# EAGLE design bareduinonano (EAGLE 6.2)
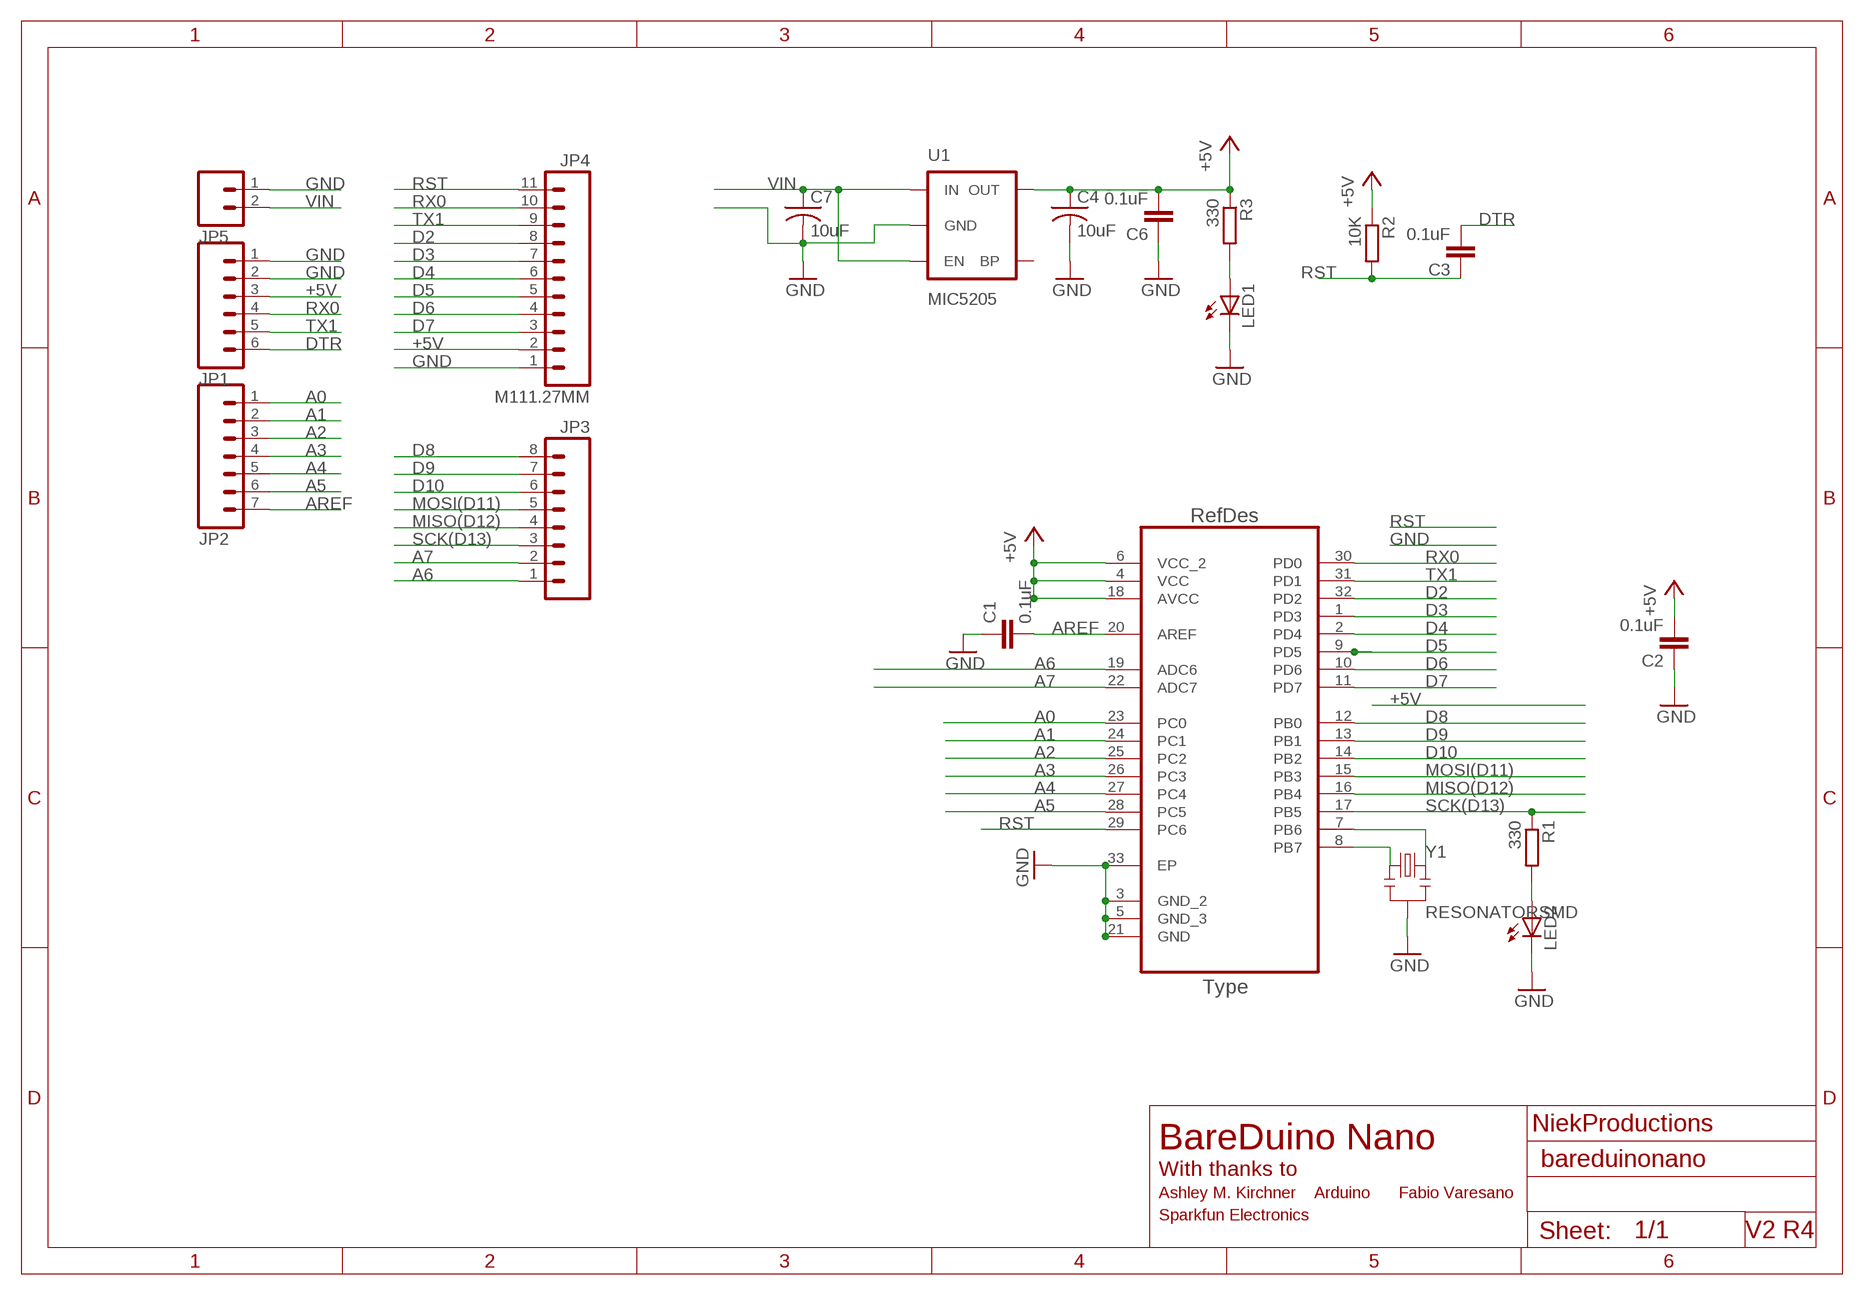
[diagram p0: schematic, sheet 1]

## Parts
C1  0.1uF  C-EUC0402K  [C0402K]
C2  0.1uF  C-EUC0402K  [C0402K]
C3  0.1uF  C-EUC0402K  [C0402K]
C4  10uF  C-USC0603K  [C0603K]
C6  0.1uF  C-EUC0402K  [C0402K]
C7  10uF  C-USC0603K  [C0603K]
JP1  M061.27MM  [1X06-1.27MM]
JP2  M071.27MM  [1X07-1.27MM]
JP3  M081.27MM  [1X08-1.27MM]
JP4  M111.27MM  [1X11-1.27MM]
JP5  M021.27MM  [1X02-1.27MM]
LED1  LED0603  [LED-0603]
LED2  LED0603  [LED-0603]
R1  330  R-EU_R0402  [R0402]
R2  10K  R-EU_R0402  [R0402]
R3  330  R-EU_R0402  [R0402]
U1  MIC5205  V_REG_LDOSMD  [SOT23-5]
UC1  ATMEGA328P-MU  [QFN50P500X500X100-33N]
Y1  RESONATORSMD  [RESONATOR-SMD]

## Nets
+5V: C2.2 C4.1 C6.2 JP1.3 JP4.2 R2.1 R3.1 U1.5(OUT) UC1.4(VCC) UC1.6(VCC_2) UC1.18(AVCC)
A0: JP2.1 UC1.23(PC0)
A1: JP2.2 UC1.24(PC1)
A2: JP2.3 UC1.25(PC2)
A3: JP2.4 UC1.26(PC3)
A4: JP2.5 UC1.27(PC4)
A5: JP2.6 UC1.28(PC5)
A6: JP3.1 UC1.19(ADC6)
A7: JP3.2 UC1.22(ADC7)
AREF: C1.2 JP2.7 UC1.20(AREF)
D2: JP4.8 UC1.32(PD2)
D3: JP4.7 UC1.1(PD3)
D4: JP4.6 UC1.2(PD4)
D5: JP4.5 UC1.9(PD5)
D6: JP4.4 UC1.10(PD6)
D7: JP4.3 UC1.11(PD7)
D8: JP3.8 UC1.12(PB0)
D9: JP3.7 UC1.13(PB1)
D10: JP3.6 UC1.14(PB2)
DTR: C3.2 JP1.6
GND: C1.1 C2.1 C4.2 C6.1 C7.2 JP1.1 JP1.2 JP4.1 JP5.1 LED1.C LED2.C U1.2(GND) UC1.3(GND_2) UC1.5(GND_3) UC1.21(GND) UC1.33(EP) Y1.2
MISO(D12): JP3.4 UC1.16(PB4)
MOSI(D11): JP3.5 UC1.15(PB3)
N$1: UC1.8(PB7) Y1.1
N$2: LED2.A R1.2
N$3: UC1.7(PB6) Y1.3
N$9: LED1.A R3.2
RST: C3.1 JP4.11 R2.2 UC1.29(PC6)
RX0: JP1.4 JP4.10 UC1.30(PD0)
SCK(D13): JP3.3 R1.1 UC1.17(PB5)
TX1: JP1.5 JP4.9 UC1.31(PD1)
VIN: C7.1 JP5.2 U1.1(IN) U1.3(EN)
Unconnected: U1.4(BP)

## Notes on the sheet
- NiekProductions
- BareDuino Nano
- With thanks to
- Ashley M. Kirchner | Arduino | Fabio Varesano
- Sparkfun Electronics
- V2 R4

## Library data of the parts
C1-C3 C6 = resistor:C-EU: CAPACITOR, European symbol
C4 C7 = adafruit:C-US: CAPACITOR, American symbol
JP1 = amk:M06: Header 6 Standard 6-pin 0.1" header. Use with straight break away headers (SKU : PRT-00116), right angle break away headers (PRT-00553), swiss pins (PRT-00743), machine pins (PRT-00117), and female headers (PRT-00115). Molex polarized connector foot print use with SKU : PRT-08094 with associated crimp pins and housings. NOTES ON THE VARIANTS LOCK and LOCK_LONGPADS... This footprint was designed to help hold the alignment of a through-hole component (i.e. 6-pin header) while soldering it into place. You may notice that each hole has been shifted either up or down by 0.005 of an inch from it's more standard position (which is a perfectly straight line). This slight alteration caused the pins (the squares in the middle) to touch the edges of the holes. Because they are alternating, it causes a "brace" to hold the component in place. 0.005 has proven to be the perfect amount of "off-center" position when using our standard breakaway headers. Although looks a little odd when you look at the bare footprint, once you have a header in there, the alteration is very hard to notice. Also, if you push a header all the way into place, it is covered up entirely on the bottom side. This idea of altering the position of holes to aid alignment will be further integrated into the Sparkfun Library for other footprints. It can help hold any component with 3 or more connection pins.
JP2 = amk:M07: Header 7 Standard 7-pin 0.1" header.
JP3 = amk:M08: Header 8 Standard 8-pin 0.1" header. Use with straight break away headers (SKU : PRT-00116), right angle break away headers (PRT-00553), swiss pins (PRT-00743), machine pins (PRT-00117), and female headers (PRT-00115).
JP4 = amk:M11: Header 11 Standard 11-pin 0.1" header. Use with straight break away headers (SKU : PRT-00116), right angle break away headers (PRT-00553), swiss pins (PRT-00743), machine pins (PRT-00117), and female headers (PRT-00115).
JP5 = amk:M02: Header 2 Standard 2-pin 0.1" header. Use with straight break away headers (SKU : PRT-00116), right angle break away headers (PRT-00553), swiss pins (PRT-00743), machine pins (PRT-00117), and female headers (PRT-00115). Molex polarized connector foot print use with SKU : PRT-08233 with associated crimp pins and housings.
LED1 LED2 = SparkFun:LED: LEDs Standard schematic elements and footprints for 5mm, 3mm, 1206, and 0603 sized LEDs. 5mm - Spark Fun Electronics SKU : COM-00529 (and others)
R1-R3 = resistor:R-EU_: RESISTOR, European symbol
U1 = SparkFun:V_REG_LDO: Voltage Regulator LDO Standard 150mA LDO voltage regulator in SOT-23 layout. Micrel part MIC5205. BP (by-pass) pin is used to lower output noise with 470pF cap.
UC1 = Niek:ATMEGA328P-MU; DESCRIPTION: Programmable Flash; MPN: ATMEGA328P-MU; OC_FARNELL: 1748522; OC_NEWARK: 26R2526; PACKAGE: QFN-32; SUPPLIER: Atmel
Y1 = SparkFun:RESONATOR: Resonator Small SMD resonator. This is the itty bitty 10/20MHz resonators with built in caps. CSTCE10M0G55 and CSTCE20M0V53. Footprint has been reviewed closely but hasn't been tested yet.

## Board
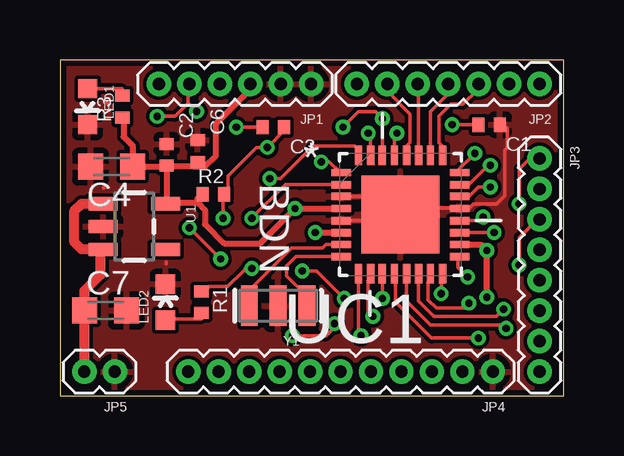
[diagram p1: board, top side]
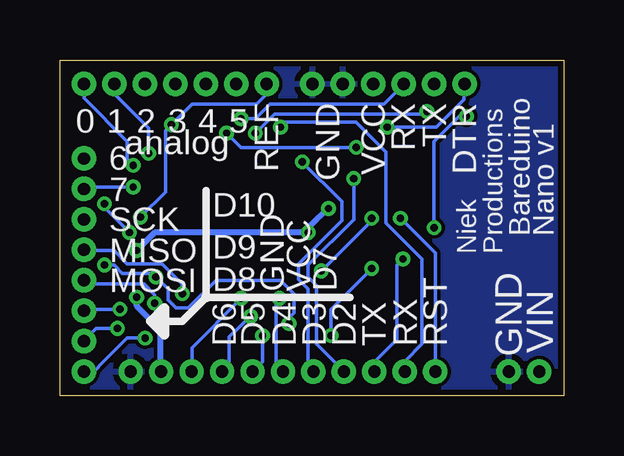
[diagram p2: board, bottom side, seen from below]

Size 21 x 14 mm. Coordinates in mm from the lower left corner, seen from the top.
Outline: 0,0 21,0 21,14 0,14 0,0
Copper layers (1*16): Top 0.035mm / dielectric 1.5mm / Bottom 0.035mm
Design rules: minimum track width 6mil, minimum drill 12mil, track to track 6mil, track to pad 6mil, pad to pad 6mil, via to via 6mil, smd to smd 0mil, copper to edge 10mil, drill to drill 10mil, minimum pad ring 10mil, minimum via ring 6mil, stop-mask expansion 2mil, vias tented up to drill 100mil, thermal gap 10mil

### Footprints (pad centres in the part's own frame; a part is rotated, then mirrored left to right if it is on the bottom)
C0402K = smd 0.5 x 0.6: 1 -0.45,0; 2 0.45,0
C0603K = smd 1.05 x 1.08: 1 -0.875,0; 2 0.875,0
1X06-1.27MM = drill 0.508 pad 1: 1 -3.175,0; 2 -1.905,0; 3 -0.635,0; 4 0.635,0; 5 1.905,0; 6 3.175,0
1X07-1.27MM = drill 0.508 pad 1: 1 -3.81,0; 2 -2.54,0; 3 -1.27,0; 4 0,0; 5 1.27,0; 6 2.54,0; 7 3.81,0
1X08-1.27MM = drill 0.508 pad 1: 1 -4.445,0; 2 -3.175,0; 3 -1.905,0; 4 -0.635,0; 5 0.635,0; 6 1.905,0; 7 3.175,0; 8 4.445,0
1X11-1.27MM = drill 0.508 pad 1: 1 -6.35,0; 2 -5.08,0; 3 -3.81,0; 4 -2.54,0; 5 -1.27,0; 6 0,0; 7 1.27,0; 8 2.54,0; 9 3.81,0; 10 5.08,0; 11 6.35,0
1X02-1.27MM = drill 0.508 pad 1: 1 -0.635,0; 2 0.635,0
LED-0603 = smd 0.8 x 0.8: A 0,-0.75; C 0,0.75
R0402 = smd 0.5 x 0.6: 1 -0.45,0; 2 0.45,0
SOT23-5 = smd 0.55 x 1.2: 1 -0.95,-1.3; 2 0,-1.3; 3 0.95,-1.3; 4 0.95,1.3; 5 -0.95,1.3
QFN50P500X500X100-33N = smd 0.813 x 0.305: 1 -2.464,1.753; 2 -2.464,1.245; 3 -2.464,0.762; 4 -2.464,0.254; 5 -2.464,-0.254; 6 -2.464,-0.762; 7 -2.464,-1.245; 8 -2.464,-1.753; 17 2.464,-1.753; 18 2.464,-1.245; 19 2.464,-0.762; 20 2.464,-0.254; 21 2.464,0.254; 22 2.464,0.762; 23 2.464,1.245; 24 2.464,1.753 | smd 0.305 x 0.813: 9 -1.753,-2.464; 10 -1.245,-2.464; 11 -0.762,-2.464; 12 -0.254,-2.464; 13 0.254,-2.464; 14 0.762,-2.464; 15 1.245,-2.464; 16 1.753,-2.464; 25 1.753,2.464; 26 1.245,2.464; 27 0.762,2.464; 28 0.254,2.464; 29 -0.254,2.464; 30 -0.762,2.464; 31 -1.245,2.464; 32 -1.753,2.464 | smd 3.251 x 3.251: 33 0,0
RESONATOR-SMD = smd 0.7 x 1.7: 1 -1.2,0; 2 0,0; 3 1.2,0

### Placement (x,y rotation side)
C1  17.9,11.3 180 top
C2  4.45,10.05 270 top
C3  8.9,11.2 180 top
C4  2.15,9.55 180 top
C6  5.75,10.2 270 top
C7  1.9,3.55 0 top
JP1  7.3,13 180 top
JP2  16.19,13 180 top
JP3  20,5.45 270 top
JP4  11.7,1 180 top
JP5  1.65,1 180 top
LED1  1.15,12.05 180 top
LED2  4.4,3.9 0 top
R1  5.9,3.9 270 top
R2  6.4,8.4 0 top
R3  2.6,12.05 90 top
U1  3.1,7.05 270 top
UC1  14.2,7.55 0 top
Y1  9.1,3.75 180 top

### Tracks (layer width: path | path; a pad name or v marks a point on that pad's centre or on a via)
+5V  (via drill 0.3)
  Top 0.254: R3.1 2.6,11.45 2.65,11.4 2.65,10.8 3.05,10.4 3.05,9.6 C4.1 3.25,9.55 4.45,9.55 | 4.45,9.55 4.6,9.55 5.6,9.55 | 4.45,9.55 C2.2 4.45,9.35 4.45,8.05 5.75,8.05 | 5.65,9.55 5.6,9.55 | 5.65,9.55 C6.2 5.6,9.55 | 5.75,8.05 | 5.75,8.05 6.05,7.75 6.05,7.15 6.85,6.35 8.35,6.35 v9.8,7.8 11.7,7.8 UC1.4 | JP1.3 7.9,13 7.9,12.75 6.5,11.35 6.5,10 6.05,9.55 5.65,9.55 | v10.65,6.8 11.8,6.8 UC1.6 | 16.5,6.3 17.55,6.3 v17.8,6.05 v17.8,4.1
  Top 0.305: 16.5,6.3 UC1.18 | 5.75,8.05 R2.1 5.75,8.2 5.75,8.05
  Top 0.406: 4.6,9.55 C2.2 | U1.5 4.45,8.05
  Bottom 0.254: v9.8,7.8 10.3,7.35 10.65,7 v10.65,6.8 17.05,6.8 v17.8,6.05 | v17.8,4.1 17.8,3.75 16.8,2.75 16.8,1 JP4.2
A0  (via drill 0.3)
  Top 0.152: v17.95,9.6 17.85,9.6 17.65,9.4 17.1,8.85 16.75,8.85 16.7,8.8 | 16.7,8.8 | 16.7,8.8 UC1.23
  Bottom 0.152: 19.96,12.95 JP2.1 | v17.95,9.6 18.2,9.85 18.2,10.6 20,12.4 JP2.1 | JP2.1
A1  (via drill 0.3)
  Top 0.152: v17.3,10.1 16.5,9.3 UC1.24
  Bottom 0.152: v17.3,10.1 17.3,11.15 18.75,12.6 18.75,13 JP2.2
A2
  Top 0.152: UC1.25 15.95,10.05 15.95,10.4 15.8,10.55 15.8,11.65 16.3,12.15 16.8,12.15 17.4,12.75 17.4,13 JP2.3
A3
  Top 0.152: UC1.26 15.45,11.85 16.15,12.55 16.15,13 JP2.4
A4
  Top 0.152: JP2.5 14.95,13 UC1.27
A5
  Top 0.152: UC1.28 14.45,10.4 14.6,10.55 14.6,11.75 13.7,12.65 13.7,13 JP2.6
A6  (via drill 0.3)
  Top 0.152: v19.15,8 19.15,9.45 19.55,9.85 20,9.85 JP3.1 | v18.1,6.8 17.6,6.8 17.4,6.8 UC1.19
  Bottom 0.152: v19.15,8 19.15,7.85 19.1,7.8 v18.1,6.8
A7  (via drill 0.3)
  Top 0.152: v17.95,8.7 17.45,8.7 17.05,8.3 16.55,8.3 UC1.22
  Bottom 0.152: 20,8.6 | 20,8.6 | 20,8.6 JP3.2 | 20,8.6 19.9,8.7 v17.95,8.7 | 20,8.6
AREF  (via drill 0.3)  (1 unrouted)
  Top 0.152: v16.35,11.3 17.25,11.3 C1.2 | v17.65,7.45 17.5,7.3 16.75,7.3 UC1.20
  Bottom 0.152: JP2.7 12.4,13 12.4,12.55 12.8,12.15 15.5,12.15 v16.35,11.3 16.6,11.05 16.6,8.5 v17.65,7.45
D2  (via drill 0.3)
  Top 0.152: v8.75,9.05 9.2,9.05 10.55,10.4 12.3,10.4 12.4,10.3 12.4,10.15 UC1.32
  Bottom 0.152: JP4.8 9.2,1 9.2,1.05 10.3,2.15 10.3,4.6 10.65,4.95 10.65,5.45 8.75,7.35 v8.75,9.05
D3  (via drill 0.3)
  Top 0.152: v10.9,9.75 11.25,9.75 11.7,9.3 UC1.1
  Bottom 0.152: JP4.7 10.45,1 10.65,1.2 10.65,4.45 11.05,4.85 11.05,5.5 9.25,7.3 9.25,8.1 v10.9,9.75
D4  (via drill 0.3)
  Top 0.152: v11.85,4.05 10.7,5.2 v10.1,5.2 | v8,7.4 9.4,8.8 10,8.8 11.7,8.8 UC1.2
  Bottom 0.152: v11.85,4.05 12,3.9 12,1.25 11.75,1 | v11.85,4.05 | 11.75,1 | 11.75,1 JP4.6 | v10.1,5.2 8,7.3 v8,7.4
D5  (via drill 0.3)
  Top 0.152: v12.55,2.5 | v12.55,2.5 12.45,2.6 12.45,5.05 UC1.9
  Bottom 0.152: JP4.5 12.95,1 12.8,1.15 12.55,1.4 v12.55,2.5
D6  (via drill 0.3)
  Top 0.152: v13.05,3.3 12.85,3.5 12.85,4.8 12.95,4.9 12.95,5.05 UC1.10
  Bottom 0.152: JP4.4 14.2,1 13.95,1.25 13.95,2.45 v13.05,3.3
D7  (via drill 0.3)
  Top 0.152: v13.45,4.05 13.45,5.05 UC1.11
  Bottom 0.152: JP4.3 15.5,1.05 15.5,2 v13.45,4.05
D8  (via drill 0.3)
  Top 0.152: v17.45,2.4 15.5,2.4 14,3.9 14,5.05 UC1.12
  Bottom 0.152: 19.15,1.45 | 19.15,1.45 18.2,2.4 v17.45,2.4 | 19.15,1.45 19.6,1 JP3.8
D9  (via drill 0.3)
  Top 0.152: v18.6,2.8 18.45,2.95 15.45,2.95 14.45,3.95 14.45,5.05 UC1.13
  Bottom 0.152: v18.6,2.8 19.5,2.8 20,2.3 JP3.7
D10  (via drill 0.3)
  Top 0.152: v18.5,3.6 18.2,3.3 15.6,3.3 15.05,3.85 | 15.05,3.85 | 15.05,3.85 14.95,3.95 14.95,5.05 UC1.14
  Bottom 0.152: v18.5,3.6 20.1,3.6 JP3.6
DTR  (via drill 0.3)
  Top 0.152: v7.35,11.2 8.15,11.2 8.25,11.2 8,11.2 C3.2
  Bottom 0.152: JP1.6 4.15,13 4.15,12.35 5.3,11.2 v7.35,11.2
GND
  Top 0.152: 13.1,7.3 11.8,7.3 12.09,7.31 11.79,7.31 UC1.5 | 13.1,7.3 14.17,6.86 UC1.33 14.33,7.01 14.48,7.81 16.61,7.81 UC1.21 | 13.1,7.3 13.1,7.02 13.1,8.3 11.7,8.3 UC1.3 | 1.98,12.19 1.9,12.24 | 4.42,5.49 4.42,5.57 | 1.83,8.69 1.83,8.65 | UC1.21 17.05,7.8 17.25,8 18.2,8 18.55,8.35 18.55,10.25 18.65,10.35 18.65,11.15 C1.1 | UC1.21
  pour Top: 0,0 21,0 21,14 0,14
  pour Bottom: 0,0 21,0 21,14 0,14
MISO(D12)  (via drill 0.3)
  Top 0.152: v15.9,4.25 15.9,5.05 UC1.16
  Bottom 0.152: JP3.4 20,6.05 18.75,6.05 18.2,5.5 17.45,5.5 17.25,5.5 16.75,5.5 15.9,4.65 v15.9,4.25
MOSI(D11)  (via drill 0.3)
  Top 0.152: v17.05,3.85 16.85,3.65 15.7,3.65 15.35,4 15.35,4.75 15.45,4.8 15.45,5.05 UC1.15
  Bottom 0.152: JP3.5 19.85,4.65 19.2,4.65 18.25,4.65 17.5,4.65 17.05,4.2 v17.05,3.85
N$1
  Top 0.152: Y1.1 10.3,4.15 9.45,5 9.45,5.4 9.85,5.8 11.7,5.8 UC1.8
N$2
  Top 0.152: LED2.A 4.38,3.2 5.9,3.2 R1.2
N$3
  Top 0.152: Y1.3 7.9,3.55 7.9,4.4 9.65,6.15 10.95,6.15 11.1,6.3 11.7,6.3 UC1.7
N$9
  Top 0.152: LED1.A 1.22,12.8 2.59,12.8 R3.2
RST  (via drill 0.3)
  Top 0.152: v6.8,7.4 6.8,8.4 R2.2 | v8.65,10.35 | v8.65,10.35 9.35,11.05 C3.1 | 7,8.4 7,9.15 8.2,10.35 v8.65,10.35 | 13.95,10.05 13.95,10.85 v14.05,10.95
  Top 0.203: 7,8.4 R2.2 | 13.95,10.05 UC1.29
  Bottom 0.152: v6.8,7.4 5.35,5.95 JP4.11 | v8.65,10.35 13.45,10.35 v14.05,10.95
RX0  (via drill 0.3)
  Top 0.152: 13.45,10.05 v13.45,11.55 | v11.8,11.2 | v11.8,11.2 12.45,11.85 13.15,11.85 v13.45,11.55 | v13.45,11.55
  Top 0.203: 13.45,10.05 UC1.30
  Bottom 0.152: v13.45,11.55 12.85,11.55 12.25,12.15 11.6,12.15 7.5,12.15 6.65,13 JP1.4 | JP4.10 6.6,1 | 6.6,1 | 6.6,1 6.6,1.45 5.9,2.15 5.9,5.7 7.4,7.2 7.4,10.15 8.65,11.4 11.6,11.4 v11.8,11.2
SCK(D13)  (via drill 0.3)
  Top 0.152: v19.15,5.45 19.15,6.6 19.9,7.35 JP3.3 | JP3.3 | v17,4.95 16.6,5.35 16.6,5.75 16.7,5.8 UC1.17 | v11.45,3 11.45,2.85 11.1,2.5 v9.7,2.5 | v8,5.3 7.75,5.3 7.65,5.2 7,4.55 6.25,4.55 R1.1
  Bottom 0.152: v19.15,5.45 | v19.15,5.45 18.75,5.45 | v17,4.95 | v17,4.95 17.15,5.1 18.4,5.1 18.75,5.45 | 18.75,5.45 | v11.45,3 11.45,3.25 11.25,3.45 11.25,4.25 11.8,4.8 14.5,4.8 15.65,3.65 16.15,3.65 16.25,3.75 16.5,4 16.5,4.45 16.95,4.9 v17,4.95 | v9.7,2.5 9.7,3.6 v8,5.3
TX1  (via drill 0.3)
  Top 0.152: 12.95,10.05 12.95,10.85 v12.85,10.95 | 5.35,12.2 | 5.35,12.2 v5.7,11.85 | 5.35,12.2 5.35,13 JP1.5 | v5.4,7 v6.7,5.7 | v4.05,11.65 4.8,11.65 5.35,12.2
  Top 0.203: 12.95,10.05 UC1.31
  Bottom 0.152: v12.85,10.95 12.05,11.75 5.8,11.75 v5.7,11.85 | JP4.9 7.85,1 7.85,1.45 6.95,2.35 6.95,4.85 6.95,5.45 v6.7,5.7 | v5.4,7 5.4,10.6 4.35,11.65 v4.05,11.65
VIN
  Top 0.406: JP5.2 1,3.5 C7.1 1.02,4.38 1.7,5.05 1.7,6 U1.3 0.9,6.1 0.6,6.4 0.6,7.7 0.9,8 U1.1

### Text on the board
tPlace: BDN
bPlace: DTR | TX | RX | VCC | GND | REF | 5 | 4 | 3 | 2 | 1 | 0 | analog | 6 | 7 | Nano v1 | Bareduino | D10 | SCK | Productions | Niek | D9 | MISO | GND | VIN | D7 | VCC | GND | D8 | MOSI | RST | RX | TX | D2 | D3 | D4 | D5 | D6